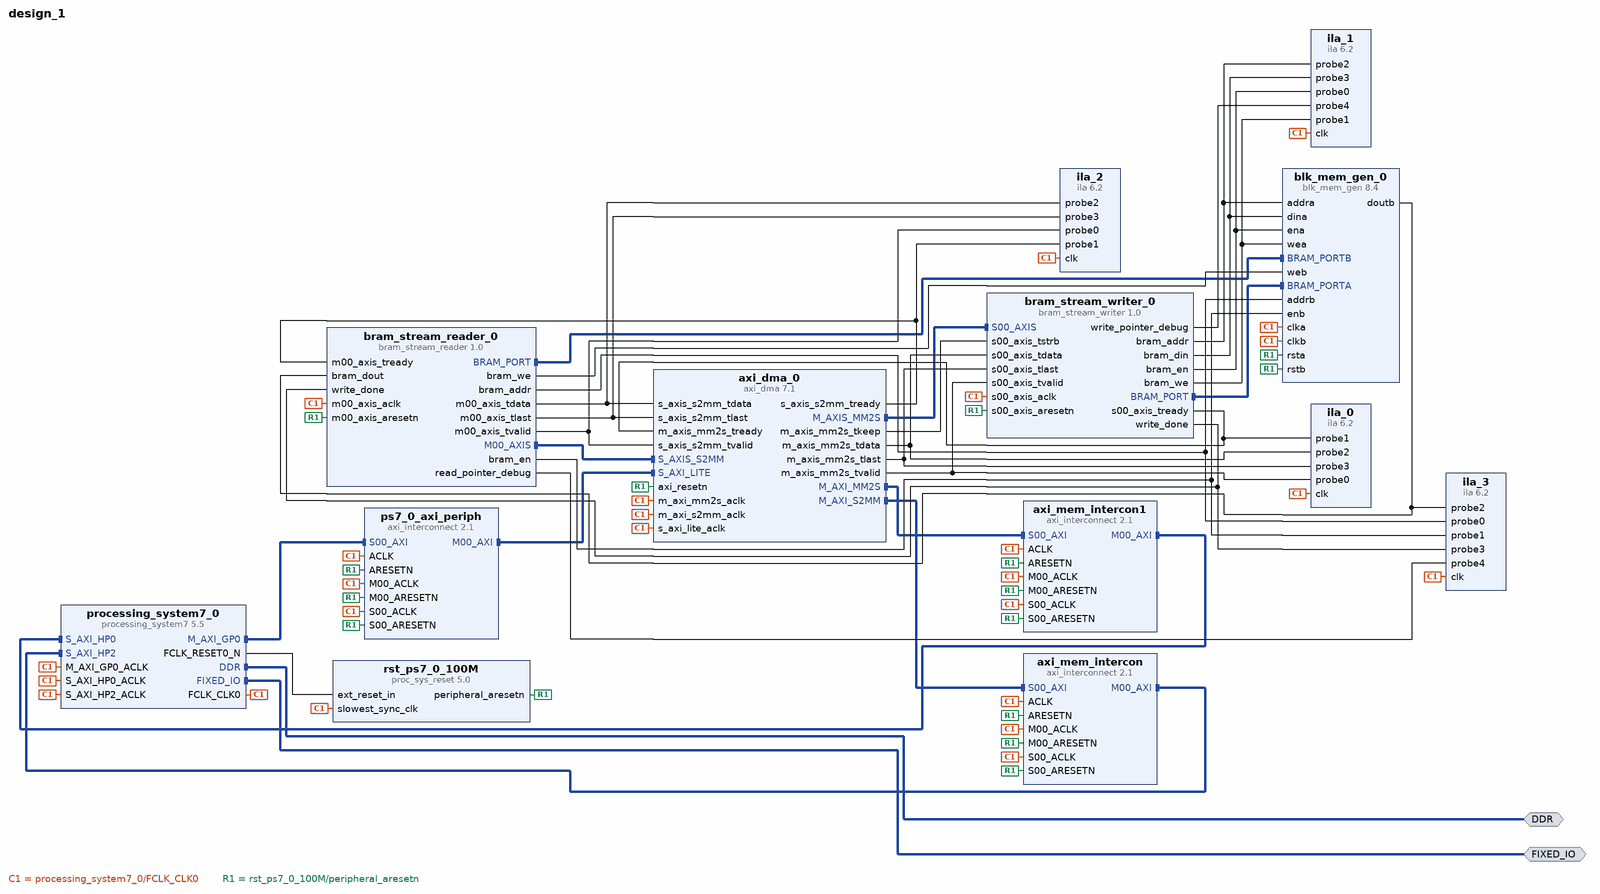
[diagram p0: block diagram of the top level]
# Vivado block design design_1, xc7z020clg400-1, Vivado 2023.2
create_bd_design design_1

create_bd_intf_port -mode Master -vlnv xilinx.com:interface:ddrx_rtl:1.0 DDR
create_bd_intf_port -mode Master -vlnv xilinx.com:display_processing_system7:fixedio_rtl:1.0 FIXED_IO

create_bd_cell -type ip -vlnv xilinx.com:ip:processing_system7:5.5 processing_system7_0
set_property -dict [list \
  CONFIG.PCW_APU_PERIPHERAL_FREQMHZ 650 \
  CONFIG.PCW_CRYSTAL_PERIPHERAL_FREQMHZ 50 \
  CONFIG.PCW_ENET0_ENET0_IO {MIO 16 .. 27} \
  CONFIG.PCW_ENET0_GRP_MDIO_ENABLE 1 \
  CONFIG.PCW_ENET0_GRP_MDIO_IO {MIO 52 .. 53} \
  CONFIG.PCW_ENET0_PERIPHERAL_ENABLE 1 \
  CONFIG.PCW_ENET0_RESET_ENABLE 1 \
  CONFIG.PCW_ENET0_RESET_IO {MIO 9} \
  CONFIG.PCW_ENET_RESET_ENABLE 1 \
  CONFIG.PCW_ENET_RESET_SELECT {Share reset pin} \
  CONFIG.PCW_FPGA0_PERIPHERAL_FREQMHZ 100 \
  CONFIG.PCW_FPGA1_PERIPHERAL_FREQMHZ 50 \
  CONFIG.PCW_GPIO_MIO_GPIO_ENABLE 1 \
  CONFIG.PCW_GPIO_MIO_GPIO_IO MIO \
  CONFIG.PCW_I2C_RESET_ENABLE 1 \
  CONFIG.PCW_M_AXI_GP0_FREQMHZ 10 \
  CONFIG.PCW_PERIPHERAL_BOARD_PRESET part0 \
  CONFIG.PCW_PRESET_BANK1_VOLTAGE {LVCMOS 1.8V} \
  CONFIG.PCW_QSPI_GRP_FBCLK_ENABLE 1 \
  CONFIG.PCW_QSPI_GRP_FBCLK_IO {MIO 8} \
  CONFIG.PCW_QSPI_GRP_SINGLE_SS_ENABLE 1 \
  CONFIG.PCW_QSPI_GRP_SINGLE_SS_IO {MIO 1 .. 6} \
  CONFIG.PCW_QSPI_PERIPHERAL_ENABLE 1 \
  CONFIG.PCW_QSPI_QSPI_IO {MIO 1 .. 6} \
  CONFIG.PCW_SD0_GRP_CD_ENABLE 1 \
  CONFIG.PCW_SD0_GRP_CD_IO {MIO 47} \
  CONFIG.PCW_SD0_GRP_WP_ENABLE 0 \
  CONFIG.PCW_SD0_PERIPHERAL_ENABLE 1 \
  CONFIG.PCW_SD0_SD0_IO {MIO 40 .. 45} \
  CONFIG.PCW_SDIO_PERIPHERAL_FREQMHZ 50 \
  CONFIG.PCW_SINGLE_QSPI_DATA_MODE x4 \
  CONFIG.PCW_S_AXI_HP0_DATA_WIDTH 32 \
  CONFIG.PCW_S_AXI_HP0_FREQMHZ 10 \
  CONFIG.PCW_S_AXI_HP1_DATA_WIDTH 32 \
  CONFIG.PCW_S_AXI_HP2_DATA_WIDTH 32 \
  CONFIG.PCW_UART0_PERIPHERAL_ENABLE 1 \
  CONFIG.PCW_UART0_UART0_IO {MIO 14 .. 15} \
  CONFIG.PCW_UART1_PERIPHERAL_ENABLE 0 \
  CONFIG.PCW_UART_PERIPHERAL_FREQMHZ 100 \
  CONFIG.PCW_UIPARAM_DDR_BUS_WIDTH {16 Bit} \
  CONFIG.PCW_UIPARAM_DDR_FREQ_MHZ 525 \
  CONFIG.PCW_UIPARAM_DDR_PARTNO {MT41J256M16 RE-125} \
  CONFIG.PCW_USB0_PERIPHERAL_ENABLE 1 \
  CONFIG.PCW_USB0_RESET_ENABLE 1 \
  CONFIG.PCW_USB0_RESET_IO {MIO 46} \
  CONFIG.PCW_USB0_USB0_IO {MIO 28 .. 39} \
  CONFIG.PCW_USB_RESET_ENABLE 1 \
  CONFIG.PCW_USB_RESET_SELECT {Share reset pin} \
  CONFIG.PCW_USE_S_AXI_HP0 1 \
  CONFIG.PCW_USE_S_AXI_HP2 1 \
] [get_bd_cells processing_system7_0]
# 484 more settings of processing_system7_0 are not shown: defaults, MIO pin electricals, DDR timing, and values the tool derives
create_bd_cell -type ip -vlnv xilinx.com:ip:axi_dma:7.1 axi_dma_0
set_property -dict {CONFIG.c_include_sg 0} [get_bd_cells axi_dma_0]
create_bd_cell -type ip -vlnv xilinx.com:ip:proc_sys_reset:5.0 rst_ps7_0_100M
create_bd_cell -type ip -vlnv xilinx.com:ip:axi_interconnect:2.1 ps7_0_axi_periph
set_property -dict {CONFIG.NUM_MI 1 CONFIG.NUM_SI 1} [get_bd_cells ps7_0_axi_periph]
create_bd_cell -type ip -vlnv xilinx.com:ip:axi_interconnect:2.1 axi_mem_intercon
set_property -dict {CONFIG.NUM_MI 1 CONFIG.NUM_SI 1} [get_bd_cells axi_mem_intercon]
create_bd_cell -type ip -vlnv xilinx.com:ip:axi_interconnect:2.1 axi_mem_intercon1
set_property -dict {CONFIG.NUM_MI 1 CONFIG.NUM_SI 1} [get_bd_cells axi_mem_intercon1]
create_bd_cell -type ip -vlnv xilinx.com:user:bram_stream_reader:1.0 bram_stream_reader_0
create_bd_cell -type ip -vlnv xilinx.com:user:bram_stream_writer:1.0 bram_stream_writer_0
create_bd_cell -type ip -vlnv xilinx.com:ip:blk_mem_gen:8.4 blk_mem_gen_0
set_property -dict [list \
  CONFIG.Assume_Synchronous_Clk true \
  CONFIG.Enable_32bit_Address true \
  CONFIG.Memory_Type True_Dual_Port_RAM \
  CONFIG.Write_Width_A 32 \
  CONFIG.use_bram_block Stand_Alone \
] [get_bd_cells blk_mem_gen_0]
create_bd_cell -type ip -vlnv xilinx.com:ip:ila:6.2 ila_0
set_property -dict [list \
  CONFIG.ALL_PROBE_SAME_MU false \
  CONFIG.C_MONITOR_TYPE Native \
  CONFIG.C_NUM_OF_PROBES 4 \
  CONFIG.C_PROBE2_WIDTH 32 \
] [get_bd_cells ila_0]
create_bd_cell -type ip -vlnv xilinx.com:ip:ila:6.2 ila_1
set_property -dict [list \
  CONFIG.ALL_PROBE_SAME_MU false \
  CONFIG.C_MONITOR_TYPE Native \
  CONFIG.C_NUM_OF_PROBES 5 \
  CONFIG.C_PROBE1_WIDTH 4 \
  CONFIG.C_PROBE2_WIDTH 32 \
  CONFIG.C_PROBE3_WIDTH 32 \
  CONFIG.C_PROBE4_WIDTH 3 \
] [get_bd_cells ila_1]
create_bd_cell -type ip -vlnv xilinx.com:ip:ila:6.2 ila_2
set_property -dict {CONFIG.C_MONITOR_TYPE Native CONFIG.C_NUM_OF_PROBES 4 CONFIG.C_PROBE2_WIDTH 32} [get_bd_cells ila_2]
create_bd_cell -type ip -vlnv xilinx.com:ip:ila:6.2 ila_3
set_property -dict [list \
  CONFIG.C_MONITOR_TYPE Native \
  CONFIG.C_NUM_OF_PROBES 5 \
  CONFIG.C_PROBE0_WIDTH 32 \
  CONFIG.C_PROBE2_WIDTH 32 \
  CONFIG.C_PROBE4_WIDTH 3 \
] [get_bd_cells ila_3]

# ---- connections ----

connect_bd_intf_net [get_bd_intf_pins bram_stream_writer_0/S00_AXIS] [get_bd_intf_pins axi_dma_0/M_AXIS_MM2S]
connect_bd_intf_net [get_bd_intf_pins axi_dma_0/M_AXI_MM2S] [get_bd_intf_pins axi_mem_intercon1/S00_AXI]
connect_bd_intf_net [get_bd_intf_pins axi_dma_0/M_AXI_S2MM] [get_bd_intf_pins axi_mem_intercon/S00_AXI]
connect_bd_intf_net [get_bd_intf_pins axi_mem_intercon1/M00_AXI] [get_bd_intf_pins processing_system7_0/S_AXI_HP0]
connect_bd_intf_net [get_bd_intf_pins axi_mem_intercon/M00_AXI] [get_bd_intf_pins processing_system7_0/S_AXI_HP2]
connect_bd_intf_net [get_bd_intf_pins bram_stream_reader_0/BRAM_PORT] [get_bd_intf_pins blk_mem_gen_0/BRAM_PORTB]
connect_bd_intf_net [get_bd_intf_pins bram_stream_reader_0/M00_AXIS] [get_bd_intf_pins axi_dma_0/S_AXIS_S2MM]
connect_bd_intf_net [get_bd_intf_pins bram_stream_writer_0/BRAM_PORT] [get_bd_intf_pins blk_mem_gen_0/BRAM_PORTA]
connect_bd_intf_net [get_bd_intf_ports DDR] [get_bd_intf_pins processing_system7_0/DDR]
connect_bd_intf_net [get_bd_intf_ports FIXED_IO] [get_bd_intf_pins processing_system7_0/FIXED_IO]
connect_bd_intf_net [get_bd_intf_pins processing_system7_0/M_AXI_GP0] [get_bd_intf_pins ps7_0_axi_periph/S00_AXI]
connect_bd_intf_net [get_bd_intf_pins ps7_0_axi_periph/M00_AXI] [get_bd_intf_pins axi_dma_0/S_AXI_LITE]
connect_bd_net [get_bd_pins bram_stream_writer_0/s00_axis_tready] [get_bd_pins ila_0/probe1] [get_bd_pins axi_dma_0/m_axis_mm2s_tready]
connect_bd_net [get_bd_pins axi_dma_0/s_axis_s2mm_tready] [get_bd_pins ila_2/probe1] [get_bd_pins bram_stream_reader_0/m00_axis_tready]
connect_bd_net [get_bd_pins blk_mem_gen_0/doutb] [get_bd_pins ila_3/probe2] [get_bd_pins bram_stream_reader_0/bram_dout]
connect_bd_net [get_bd_pins axi_dma_0/m_axis_mm2s_tdata] [get_bd_pins ila_0/probe2] [get_bd_pins bram_stream_writer_0/s00_axis_tdata]
connect_bd_net [get_bd_pins axi_dma_0/m_axis_mm2s_tkeep] [get_bd_pins bram_stream_writer_0/s00_axis_tstrb]
connect_bd_net [get_bd_pins axi_dma_0/m_axis_mm2s_tlast] [get_bd_pins ila_0/probe3] [get_bd_pins bram_stream_writer_0/s00_axis_tlast]
connect_bd_net [get_bd_pins axi_dma_0/m_axis_mm2s_tvalid] [get_bd_pins ila_0/probe0] [get_bd_pins bram_stream_writer_0/s00_axis_tvalid]
connect_bd_net [get_bd_pins bram_stream_reader_0/bram_addr] [get_bd_pins ila_3/probe0] [get_bd_pins blk_mem_gen_0/addrb]
connect_bd_net [get_bd_pins bram_stream_reader_0/bram_en] [get_bd_pins ila_3/probe1] [get_bd_pins blk_mem_gen_0/enb]
connect_bd_net [get_bd_pins bram_stream_reader_0/bram_we] [get_bd_pins blk_mem_gen_0/web]
connect_bd_net [get_bd_pins bram_stream_reader_0/m00_axis_tdata] [get_bd_pins ila_2/probe2] [get_bd_pins axi_dma_0/s_axis_s2mm_tdata]
connect_bd_net [get_bd_pins bram_stream_reader_0/m00_axis_tlast] [get_bd_pins ila_2/probe3] [get_bd_pins axi_dma_0/s_axis_s2mm_tlast]
connect_bd_net [get_bd_pins bram_stream_reader_0/m00_axis_tvalid] [get_bd_pins ila_2/probe0] [get_bd_pins axi_dma_0/s_axis_s2mm_tvalid]
connect_bd_net [get_bd_pins bram_stream_reader_0/read_pointer_debug] [get_bd_pins ila_3/probe4]
connect_bd_net [get_bd_pins bram_stream_writer_0/bram_addr] [get_bd_pins ila_1/probe2] [get_bd_pins blk_mem_gen_0/addra]
connect_bd_net [get_bd_pins bram_stream_writer_0/bram_din] [get_bd_pins ila_1/probe3] [get_bd_pins blk_mem_gen_0/dina]
connect_bd_net [get_bd_pins bram_stream_writer_0/bram_en] [get_bd_pins ila_1/probe0] [get_bd_pins blk_mem_gen_0/ena]
connect_bd_net [get_bd_pins bram_stream_writer_0/bram_we] [get_bd_pins ila_1/probe1] [get_bd_pins blk_mem_gen_0/wea]
connect_bd_net [get_bd_pins bram_stream_writer_0/write_done] [get_bd_pins ila_3/probe3] [get_bd_pins bram_stream_reader_0/write_done]
connect_bd_net [get_bd_pins bram_stream_writer_0/write_pointer_debug] [get_bd_pins ila_1/probe4]
connect_bd_net [get_bd_pins processing_system7_0/FCLK_CLK0] \
  [get_bd_pins processing_system7_0/M_AXI_GP0_ACLK] [get_bd_pins rst_ps7_0_100M/slowest_sync_clk] \
  [get_bd_pins axi_dma_0/s_axi_lite_aclk] [get_bd_pins axi_dma_0/m_axi_mm2s_aclk] [get_bd_pins axi_dma_0/m_axi_s2mm_aclk] \
  [get_bd_pins processing_system7_0/S_AXI_HP0_ACLK] [get_bd_pins ps7_0_axi_periph/ACLK] \
  [get_bd_pins ps7_0_axi_periph/S00_ACLK] [get_bd_pins ps7_0_axi_periph/M00_ACLK] [get_bd_pins axi_mem_intercon/ACLK] \
  [get_bd_pins axi_mem_intercon/S00_ACLK] [get_bd_pins axi_mem_intercon/M00_ACLK] \
  [get_bd_pins processing_system7_0/S_AXI_HP2_ACLK] [get_bd_pins axi_mem_intercon1/ACLK] \
  [get_bd_pins axi_mem_intercon1/M00_ACLK] [get_bd_pins axi_mem_intercon1/S00_ACLK] [get_bd_pins ila_0/clk] \
  [get_bd_pins ila_1/clk] [get_bd_pins ila_2/clk] [get_bd_pins ila_3/clk] [get_bd_pins blk_mem_gen_0/clka] \
  [get_bd_pins blk_mem_gen_0/clkb] [get_bd_pins bram_stream_writer_0/s00_axis_aclk] \
  [get_bd_pins bram_stream_reader_0/m00_axis_aclk]
connect_bd_net [get_bd_pins processing_system7_0/FCLK_RESET0_N] [get_bd_pins rst_ps7_0_100M/ext_reset_in]
connect_bd_net [get_bd_pins rst_ps7_0_100M/peripheral_aresetn] \
  [get_bd_pins axi_dma_0/axi_resetn] [get_bd_pins ps7_0_axi_periph/S00_ARESETN] [get_bd_pins ps7_0_axi_periph/M00_ARESETN] \
  [get_bd_pins ps7_0_axi_periph/ARESETN] [get_bd_pins axi_mem_intercon/S00_ARESETN] \
  [get_bd_pins axi_mem_intercon/M00_ARESETN] [get_bd_pins axi_mem_intercon/ARESETN] [get_bd_pins axi_mem_intercon1/ARESETN] \
  [get_bd_pins axi_mem_intercon1/M00_ARESETN] [get_bd_pins axi_mem_intercon1/S00_ARESETN] [get_bd_pins blk_mem_gen_0/rstb] \
  [get_bd_pins blk_mem_gen_0/rsta] [get_bd_pins bram_stream_writer_0/s00_axis_aresetn] \
  [get_bd_pins bram_stream_reader_0/m00_axis_aresetn]
set_property HDL_ATTRIBUTE.BMM_INFO_PROCESSOR {arm > design_1 axi_bram_ctrl_0} [get_bd_cells processing_system7_0]
set_property HDL_ATTRIBUTE.KEEP_HIERARCHY yes [get_bd_cells processing_system7_0]

# ---- address map ----
assign_bd_address -offset 0x00000000 -range 512M -target_address_space [get_bd_addr_spaces axi_dma_0/Data_MM2S] [get_bd_addr_segs processing_system7_0/S_AXI_HP0/HP0_DDR_LOWOCM]
assign_bd_address -offset 0x00000000 -range 512M -target_address_space [get_bd_addr_spaces axi_dma_0/Data_S2MM] [get_bd_addr_segs processing_system7_0/S_AXI_HP2/HP2_DDR_LOWOCM]
assign_bd_address -offset 0x40400000 -range 64K -target_address_space [get_bd_addr_spaces processing_system7_0/Data] [get_bd_addr_segs axi_dma_0/S_AXI_LITE/Reg]

validate_bd_design
save_bd_design
